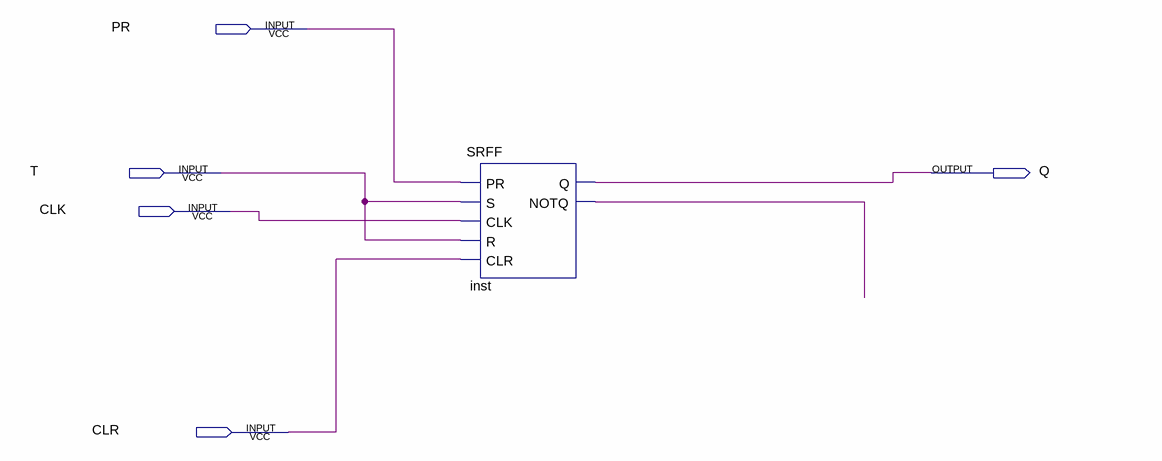
[diagram p0: schematic sheet]
// Quartus schematic TFF.bdf as structural Verilog: 1 symbols, 5 pins
module TFF (
  input  PR,
  input  T,
  input  CLK,
  input  CLR,
  output Q
);

  wire inst_notq;

  SRFF inst (.PR(PR), .S(T), .CLK(CLK), .R(T), .CLR(CLR), .Q(Q), .NOTQ(inst_notq));
endmodule
